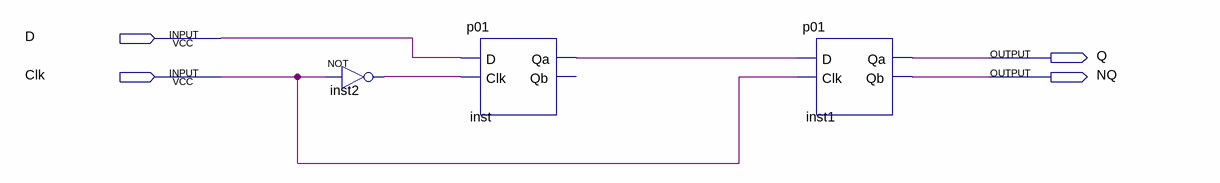
[diagram p0: schematic sheet]
// Quartus schematic p02.bdf as structural Verilog: 3 symbols, 4 pins
module p02 (
  input  D,
  input  Clk,
  output Q,
  output NQ
);

  wire inst2_out, inst_qa;

  not inst2 (inst2_out, Clk);
  p01 inst (.D(D), .Clk(inst2_out), .Qa(inst_qa));  // open: Qb
  p01 inst1 (.D(inst_qa), .Clk(Clk), .Qa(Q), .Qb(NQ));
endmodule
